# EAGLE schematic 6502_R8 (EAGLE 7.5.0)
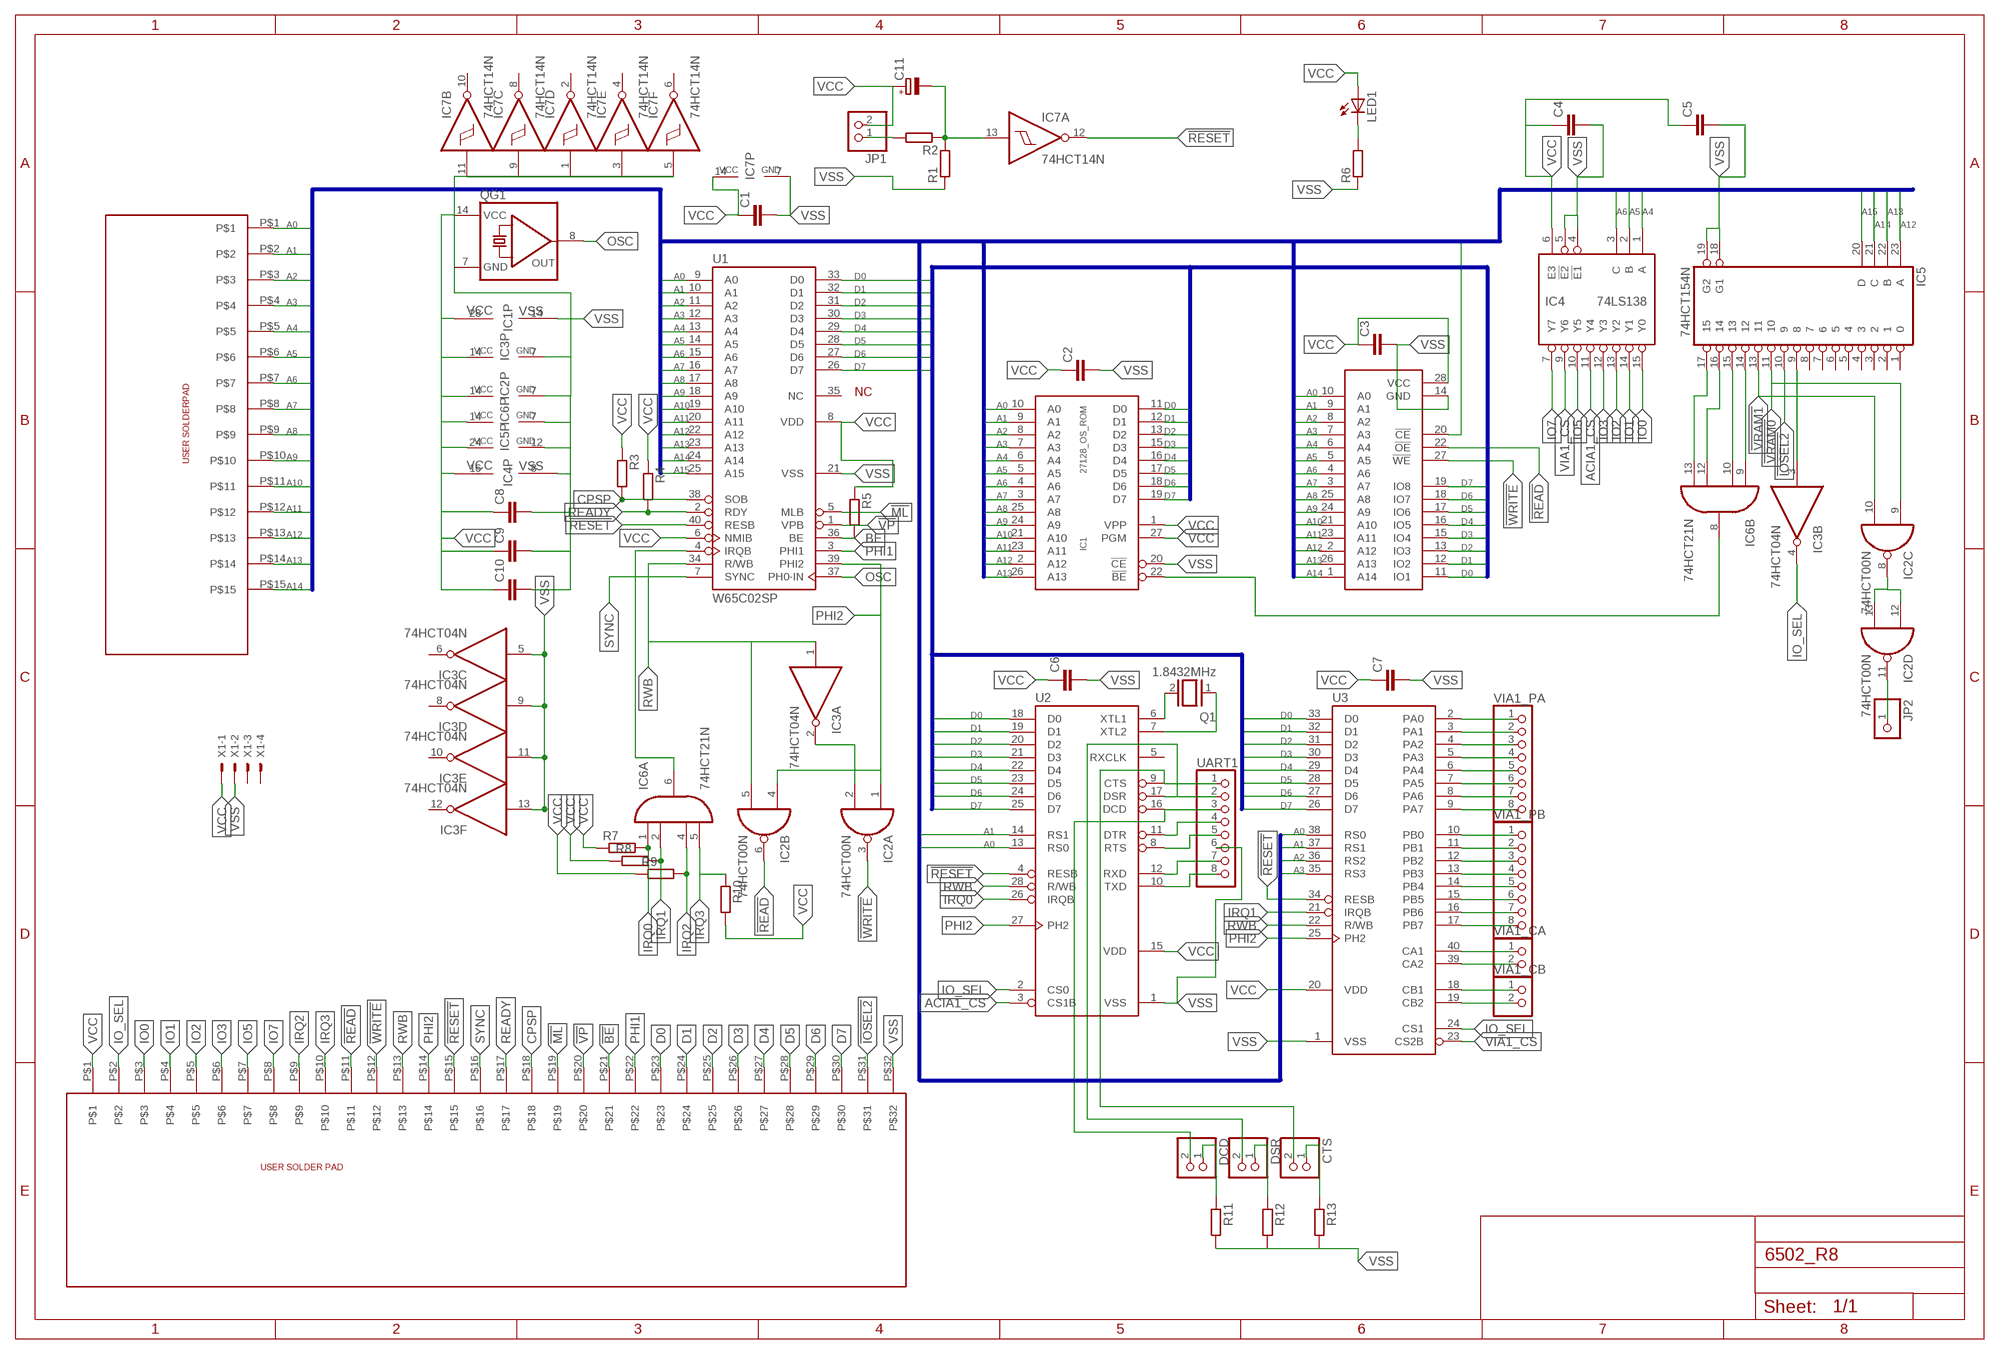
[diagram p0: schematic, sheet 1]

## Parts
C1  C-EU025-024X044  [C025-024X044]
C2  C-EU025-024X044  [C025-024X044]
C3  C-EU025-024X044  [C025-024X044]
C4  C-EU025-024X044  [C025-024X044]
C5  C-EU025-024X044  [C025-024X044]
C6  C-EU025-024X044  [C025-024X044]
C7  C-EU025-024X044  [C025-024X044]
C8  C-EU025-024X044  [C025-024X044]
C9  C-EU025-024X044  [C025-024X044]
C10  C-EU025-024X044  [C025-024X044]
C11  CPOL-EUTT2D7  [TT2D7]
CTS  PINHD-1X2  [1X02]
DCD  PINHD-1X2  [1X02]
DSR  PINHD-1X2  [1X02]
IC1  27128_OS_ROM  [DIL28]
IC2  74HCT00N  [DIL14]
IC3  74HCT04N  [DIL14]
IC4  74LS138  [DIL16]
IC5  74HCT154N  [DIL24-6]
IC6  74HCT21N  [DIL14]
IC7  74HCT14N  [DIL14]
JP1  PINHD-1X2  [1X02]
JP2  PINHD-1X1  [1X01]
LED1  LED5MM  [LED5MM]
Q1  1.8432MHz  XTAL  [Q]
QG1  QG5860  [DIL14S]
R1  R-EU_0207/7  [0207/7]
R2  R-EU_0207/7  [0207/7]
R3  R-EU_0207/7  [0207/7]
R4  R-EU_0207/7  [0207/7]
R5  R-EU_0207/7  [0207/7]
R6  R-EU_0207/7  [0207/7]
R7  R-EU_0207/7  [0207/7]
R8  R-EU_0207/7  [0207/7]
R9  R-EU_0207/7  [0207/7]
R10  R-EU_0207/7  [0207/7]
R11  R-EU_0207/7  [0207/7]
R12  R-EU_0207/7  [0207/7]
R13  R-EU_0207/7  [0207/7]
U1  W65C02SP  [DIP-40]
U2  G65SC51P  [DIP-28]
U3  G65SC22P  [DIP-40]
U$1  CXK58258AP-20  [DIL28-3]
U$2  SOLDERPAD  [SOLDERPAD]
U$3  SOLDERPAD2  [SOLDERPAD2]
UART1  PINHD-1X8  [1X08]
VIA1_CA  PINHD-1X2  [1X02]
VIA1_CB  PINHD-1X2  [1X02]
VIA1_PA  PINHD-1X8  [1X08]
VIA1_PB  PINHD-1X8  [1X08]
X1  KK-156-4  [KK-156-4]

## Nets
!BE: U$2.P$21
!IOSEL2: IC5.10 U$2.P$31
!ML: U1.5(MLB) U$2.P$19
!READ: IC2.6(B:O) U$1.22(!OE) U$2.P$11
!RESET: IC7.12(A:O) U1.40(RESB) U2.4(RESB) U3.34(RESB) U$2.P$15
!VP: U1.1(VPB) U$2.P$20
!VRAM0: IC2.9(C:I0) IC5.11
!VRAM1: IC2.10(C:I1) IC5.13
!WRITE: IC2.3(A:O) U$1.27(!WE) U$2.P$12
A0: IC1.10(A0) U1.9(A0) U2.13(RS0) U3.38(RS0) U$1.10(A0) U$3.P$1
A1: IC1.9(A1) U1.10(A1) U2.14(RS1) U3.37(RS1) U$1.9(A1) U$3.P$2
A2: IC1.8(A2) U1.11(A2) U3.36(RS2) U$1.8(A2) U$3.P$3
A3: IC1.7(A3) U1.12(A3) U3.35(RS3) U$1.7(A3) U$3.P$4
A4: IC1.6(A4) IC4.1(A) U1.13(A4) U$1.6(A4) U$3.P$5
A5: IC1.5(A5) IC4.2(B) U1.14(A5) U$1.5(A5) U$3.P$6
A6: IC1.4(A6) IC4.3(C) U1.15(A6) U$1.4(A6) U$3.P$7
A7: IC1.3(A7) U1.16(A7) U$1.3(A7) U$3.P$8
A8: IC1.25(A8) U1.17(A8) U$1.25(A8) U$3.P$9
A9: IC1.24(A9) U1.18(A9) U$1.24(A9) U$3.P$10
A10: IC1.21(A10) U1.19(A10) U$1.21(A10) U$3.P$11
A11: IC1.23(A11) U1.20(A11) U$1.23(A11) U$3.P$12
A12: IC1.2(A12) IC5.23(A) U1.22(A12) U$1.2(A12) U$3.P$13
A13: IC1.26(A13) IC5.22(B) U1.23(A13) U$1.26(A13) U$3.P$14
A14: IC5.21(C) U1.24(A14) U$1.1(A14) U$3.P$15
A15: IC5.20(D) U1.25(A15) U$1.20(!CE)
ACIA1_CS: IC4.11(Y4) U2.3(CS1B)
BE: R5.2 U1.36(BE)
CPSP: R3.2 U1.38(SOB) U$2.P$18
D0: IC1.11(D0) U1.33(D0) U2.18(D0) U3.33(D0) U$1.11(IO1) U$2.P$23
D1: IC1.12(D1) U1.32(D1) U2.19(D1) U3.32(D1) U$1.12(IO2) U$2.P$24
D2: IC1.13(D2) U1.31(D2) U2.20(D2) U3.31(D2) U$1.13(IO3) U$2.P$25
D3: IC1.15(D3) U1.30(D3) U2.21(D3) U3.30(D3) U$1.15(IO4) U$2.P$26
D4: IC1.16(D4) U1.29(D4) U2.22(D4) U3.29(D4) U$1.16(IO5) U$2.P$27
D5: IC1.17(D5) U1.28(D5) U2.23(D5) U3.28(D5) U$1.17(IO6) U$2.P$28
D6: IC1.18(D6) U1.27(D6) U2.24(D6) U3.27(D6) U$1.18(IO7) U$2.P$29
D7: IC1.19(D7) U1.26(D7) U2.25(D7) U3.26(D7) U$1.19(IO8) U$2.P$30
IO0: IC4.15(Y0) U$2.P$3
IO1: IC4.14(Y1) U$2.P$4
IO2: IC4.13(Y2) U$2.P$5
IO3: IC4.12(Y3) U$2.P$6
IO5: IC4.10(Y5) U$2.P$7
IO7: IC4.7(Y7) U$2.P$8
IO_SEL: IC3.4(B:O) U2.2(CS0) U3.24(CS1) U$2.P$2
IRQ0: IC6.1(A:I0) R7.2 U2.26(IRQB)
IRQ1: IC6.2(A:I1) R8.2 U3.21(IRQB)
IRQ2: IC6.4(A:I2) R9.2 U$2.P$9
IRQ3: IC6.5(A:I3) R10.1 U$2.P$10
N$1: IC3.3(B:I) IC5.9
N$2: IC5.17 IC6.13(B:I3)
N$3: IC5.16 IC6.12(B:I2)
N$4: IC5.15 IC6.10(B:I1)
N$5: IC5.14 IC6.9(B:I0)
N$6: IC1.22(!BE) IC6.8(B:O)
N$9: IC2.2(A:I1) IC3.2(A:O)
N$10: Q1.2 U2.6(XTL1)
N$11: Q1.1 U2.7(XTL2)
N$12: IC6.6(A:O) U1.4(IRQB)
N$15: IC2.8(C:O) IC2.12(D:I0) IC2.13(D:I1)
N$16: IC2.11(D:O) JP2.1
N$17: U3.2(PA0) VIA1_PA.1
N$18: C11.- IC7.13(A:I) R1.2 R2.1
N$19: JP1.1 R2.2
N$20: U3.3(PA1) VIA1_PA.2
N$21: U3.4(PA2) VIA1_PA.3
N$22: LED1.K(C) R6.2
N$23: U3.5(PA3) VIA1_PA.4
N$24: U3.6(PA4) VIA1_PA.5
N$25: U3.7(PA5) VIA1_PA.6
N$26: U3.8(PA6) VIA1_PA.7
N$27: U3.9(PA7) VIA1_PA.8
N$28: U3.10(PB0) VIA1_PB.1
N$29: U3.11(PB1) VIA1_PB.2
N$30: U3.12(PB2) VIA1_PB.3
N$31: U3.13(PB3) VIA1_PB.4
N$32: U3.14(PB4) VIA1_PB.5
N$33: U3.15(PB5) VIA1_PB.6
N$34: U3.16(PB6) VIA1_PB.7
N$35: U3.17(PB7) VIA1_PB.8
N$36: U3.40(CA1) VIA1_CA.1
N$37: U3.39(CA2) VIA1_CA.2
N$38: U3.18(CB1) VIA1_CB.1
N$39: U3.19(CB2) VIA1_CB.2
N$40: U2.10(TXD) UART1.8
N$41: U2.12(RXD) UART1.7
N$42: CTS.2 U2.9(CTS) UART1.1
N$43: DSR.2 U2.17(DSR) UART1.2
N$44: DCD.2 U2.16(DCD) UART1.3
N$45: U2.11(DTR) UART1.4
N$46: U2.8(RTS) UART1.5
N$47: DCD.1 R11.1
N$48: DSR.1 R12.1
N$49: CTS.1 R13.1
OSC: QG1.8(OUT) U1.37(PH0-IN)
PHI1: U1.3(PHI1) U$2.P$22
PHI2: IC2.1(A:I0) IC2.4(B:I0) U1.39(PHI2) U2.27(PH2) U3.25(PH2) U$2.P$14
READY: R4.2 U1.2(RDY) U$2.P$17
RWB: IC2.5(B:I1) IC3.1(A:I) U1.34(R/WB) U2.28(R/WB) U3.22(R/WB) U$2.P$13
SYNC: U1.7(SYNC) U$2.P$16
VCC [Power]: C1.1 C2.1 C3.1 C4.1 C5.1 C6.1 C7.1 C8.1 C9.1 C10.1 C11.+ IC1.1(VPP) IC1.27(PGM) IC1.28(VCC) IC2.14(P:VCC) IC3.14(P:VCC) IC4.6(E3) IC4.16(VCC) IC5.24(VCC) IC6.14(P:VCC) IC7.14(P:VCC) JP1.2 LED1.A QG1.14(VCC) R3.1 R4.1 R5.1 R7.1 R8.1 R9.1 R10.2 U1.6(NMIB) U1.8(VDD) U2.15(VDD) U3.20(VDD) U$1.28(VCC) U$2.P$1 X1.1
VIA1_CS: IC4.9(Y6) U3.23(CS2B)
VSS [Power]: C1.2 C2.2 C3.2 C4.2 C5.2 C6.2 C7.2 C8.2 C9.2 C10.2 IC1.14(VSS) IC1.20(!CE) IC2.7(P:GND) IC3.5(C:I) IC3.7(P:GND) IC3.9(D:I) IC3.11(E:I) IC3.13(F:I) IC4.4(!E1) IC4.5(!E2) IC4.8(VSS) IC5.12(GND) IC5.18(G1) IC5.19(G2) IC6.7(P:GND) IC7.1(D:I) IC7.3(E:I) IC7.5(F:I) IC7.7(P:GND) IC7.9(C:I) IC7.11(B:I) QG1.7(GND) R1.1 R6.1 R11.2 R12.2 R13.2 U1.21(VSS) U2.1(VSS) U3.1(VSS) U$1.14(GND) U$2.P$32 UART1.6 X1.2
Unconnected: IC3.6(C:O) IC3.8(D:O) IC3.10(E:O) IC3.12(F:O) IC5.1 IC5.2 IC5.3 IC5.4 IC5.5 IC5.6 IC5.7 IC5.8 IC7.2(D:O) IC7.4(E:O) IC7.6(F:O) IC7.8(C:O) IC7.10(B:O) U1.35(NC) U2.5(RXCLK) X1.3 X1.4

## Buses
D[0..7]
A[0..15]

## Library data of the parts
C1-C10 = rcl:C-EU: CAPACITOR, European symbol
C11 = rcl:CPOL-EU: POLARIZED CAPACITOR, European symbol
CTS DCD DSR VIA1_CA VIA1_CB = pinhead:PINHD-1X2: PIN HEADER
IC1 = logik:27128_OS_ROM: 16K x 8 PROM
IC2 = logik:74*00: Quad 2-input NAND gate
IC3 = logik:74*04: Hex INVERTER
IC4 = eagle-6.5.0-atari:74LS138: 3-Line To 8-Line Decoder
IC5 = logik:74*154: 4-line to 16-line data SELECTOR/MULTIPLEXER
IC6 = 74xx-eu:74*21: Dual 4-input AND gate
IC7 = 74xx-eu:74*14: Hex schmitt trigger INVERTER
JP1 = logik:PINHD-1X2: PIN HEADER
JP2 = pinhead:PINHD-1X1: PIN HEADER
LED1 = led:LED: LED OSRAM: - CHIPLED LG R971, LG N971, LY N971, LG Q971, LY Q971, LO R971, LY R971 LH N974, LH R974 LS Q976, LO Q976, LY Q976 LO Q996 - Hyper CHIPLED LW Q18S LB Q993, LB Q99A, LB R99A - SideLED LS A670, LO A670, LY A670, LG A670, LP A670 LB A673, LV A673, LT A673, LW A673 LH A674 LY A675 LS A676, LA A676, LO A676, LY A676, LW A676 LS A679, LY A679, LG A679 - Hyper Micro SIDELED® LS Y876, LA Y876, LO Y876, LY Y876 LT Y87S - SmartLED LW L88C, LW L88S LB L89C, LB L89S, LG L890 LS L89K, LO L89K, LY L89K LS L896, LA L896, LO L896, LY L896 - TOPLED LS T670, LO T670, LY T670, LG T670, LP T670 LSG T670, LSP T670, LSY T670, LOP T670, LYG T670 LG T671, LOG T671, LSG T671 LB T673, LV T673, LT T673, LW T673 LH T674 LS T676, LA T676, LO T676, LY T676, LB T676, LH T676, LSB T676, LW T676 LB T67C, LV T67C, LT T67C, LS T67K, LO T67K, LY T67K, LW E67C LS E67B, LA E67B, LO E67B, LY E67B, LB E67C, LV E67C, LT E67C LW T67C LS T679, LY T679, LG T679 LS T770, LO T770, LY T770, LG T770, LP T770 LB T773, LV T773, LT T773, LW T773 LH T774 LS E675, LA E675, LY E675, LS T675 LS T776, LA T776, LO T776, LY T776, LB T776 LHGB T686 LT T68C, LB T68C - Hyper Mini TOPLED® LB M676 - Mini TOPLED Santana® LG M470 LS M47K, LO M47K, LY M47K Source: http://www.osram.convergy.de LUXEON: - LUMILED® LXK2-PW12-R00, LXK2-PW12-S00, LXK2-PW14-U00, LXK2-PW14-V00 LXK2-PM12-R00, LXK2-PM12-S00, LXK2-PM14-U00 LXK2-PE12-Q00, LXK2-PE12-R00, LXK2-PE12-S00, LXK2-PE14-T00, LXK2-PE14-U00 LXK2-PB12-K00, LXK2-PB12-L00, LXK2-PB12-M00, LXK2-PB14-N00, LXK2-PB14-P00, LXK2-PB14-Q00 LXK2-PR12-L00, LXK2-PR12-M00, LXK2-PR14-Q00, LXK2-PR14-R00 LXK2-PD12-Q00, LXK2-PD12-R00, LXK2-PD12-S00 LXK2-PH12-R00, LXK2-PH12-S00 LXK2-PL12-P00, LXK2-PL12-Q00, LXK2-PL12-R00 Source: www.luxeon.com KINGBRIGHT: KA-3528ASYC Source: www.kingbright.com
Q1 = special:XTAL: CRYSTAL
QG1 = logik:QG5860: CRYSTAL RESONATOR; OC_FARNELL: unknown; OC_NEWARK: unknown
R1-R13 = rcl:R-EU_: RESISTOR, European symbol
U1 = logik:W65C02SP: Western Digital Version
U2 = 65xxx:G65SC51P: California Micro Devices Version
U3 = 65xxx:G65SC22P: California Micro Devices Version
U$1 = logik:CXK58258AP-20
U$2 = logik:SOLDERPAD
U$3 = logik:SOLDERPAD2
UART1 VIA1_PA VIA1_PB = pinhead:PINHD-1X8: PIN HEADER
X1 = con-molex:KK-156-4: KK 156 HEADER Source: http://www.molex.com/pdm_docs/sd/026604100_sd.pdf; OC_FARNELL: unknown; OC_NEWARK: unknown

## Net classes
1 Power: width 1.016 mm, drill 0.508 mm, clearance 0.254 mm